# EAGLE design Controller (EAGLE 6.5.0)
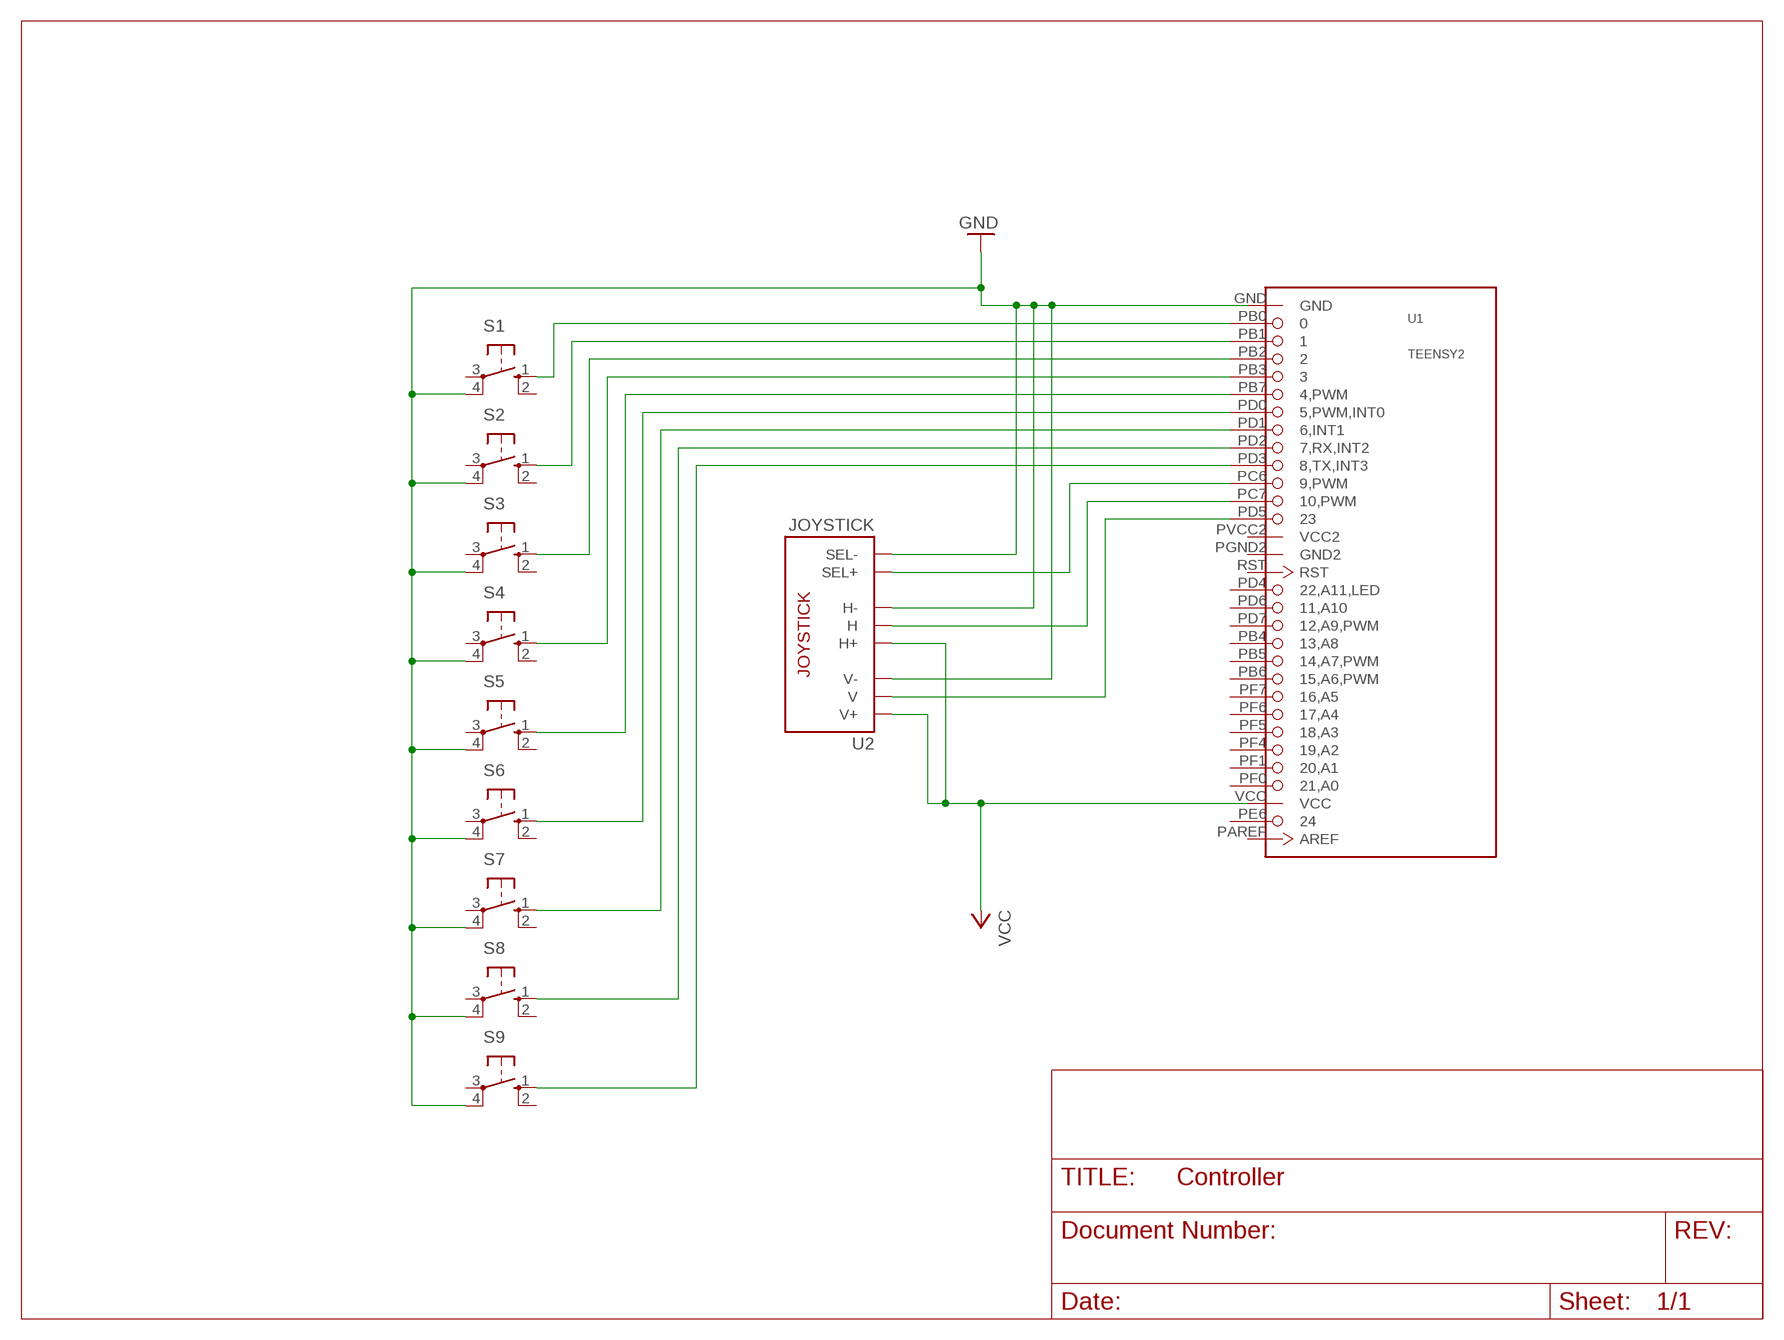
[diagram p0: schematic, sheet 1]

## Parts
S1  10-XX  [B3F-10XX]
S2  10-XX  [B3F-10XX]
S3  10-XX  [B3F-10XX]
S4  10-XX  [B3F-10XX]
S5  10-XX  [B3F-10XX]
S6  10-XX  [B3F-10XX]
S7  10-XX  [B3F-10XX]
S8  10-XX  [B3F-10XX]
S9  10-XX  [B3F-10XX]
U1  TEENSY2  TEENSY2-ARDUINO  [TEENSY2]
U2  JOYSTICK  JOYSTICKPTH  [JOYSTICK]

## Nets
GND: S1.4(P1) S2.4(P1) S3.4(P1) S4.4(P1) S5.4(P1) S6.4(P1) S7.4(P1) S8.4(P1) S9.4(P1) U1.GND U2.B2A(SEL-) U2.H3(H-) U2.V3(V-)
N$1: S1.1(S) U1.PB0
N$2: S2.1(S) U1.PB1
N$3: S3.1(S) U1.PB2
N$4: S4.1(S) U1.PB3
N$5: S5.1(S) U1.PB7(4,PWM)
N$6: S6.1(S) U1.PD0(5,PWM,INT0)
N$7: S7.1(S) U1.PD1(6,INT1)
N$8: S8.1(S) U1.PD2(7,RX,INT2)
N$9: U1.PD5 U2.V2(V)
N$10: U1.PC7(10,PWM) U2.H2(H)
N$11: U1.PC6(9,PWM) U2.B1A(SEL+)
N$12: S9.1(S) U1.PD3(8,TX,INT3)
VCC: U1.VCC U2.H1(H+) U2.V1(V+)
Unconnected: S1.2(S1) S1.3(P) S2.2(S1) S2.3(P) S3.2(S1) S3.3(P) S4.2(S1) S4.3(P) S5.2(S1) S5.3(P) S6.2(S1) S6.3(P) S7.2(S1) S7.3(P) S8.2(S1) S8.3(P) S9.2(S1) S9.3(P) U1.PAREF(AREF) U1.PB4(13,A8) U1.PB5(14,A7,PWM) U1.PB6(15,A6,PWM) U1.PD4(22,A11,LED) U1.PD6(11,A10) U1.PD7(12,A9,PWM) U1.PE6 U1.PF0(21,A0) U1.PF1(20,A1) U1.PF4(19,A2) U1.PF5(18,A3) U1.PF6(17,A4) U1.PF7(16,A5) U1.RST

## Power pins joined to a net without a drawn wire
GND2: U1.PGND2(GND2)
VCC2: U1.PVCC2(VCC2)

## Library data of the parts
S1-S9 = switch-omron:10-XX: OMRON SWITCH; MPN: B3F-1000; OC_FARNELL: 176432; OC_NEWARK: 36M3542
U1 = teensy2:TEENSY2-ARDUINO
U2 = SparkFun-Electromechanical:JOYSTICK: Thumb Joystick Joystick commonly found in PS2 controllers. Two pots and a select switch. Footprint proven. Spark Fun Electronics SKU : COM-09032

## Board
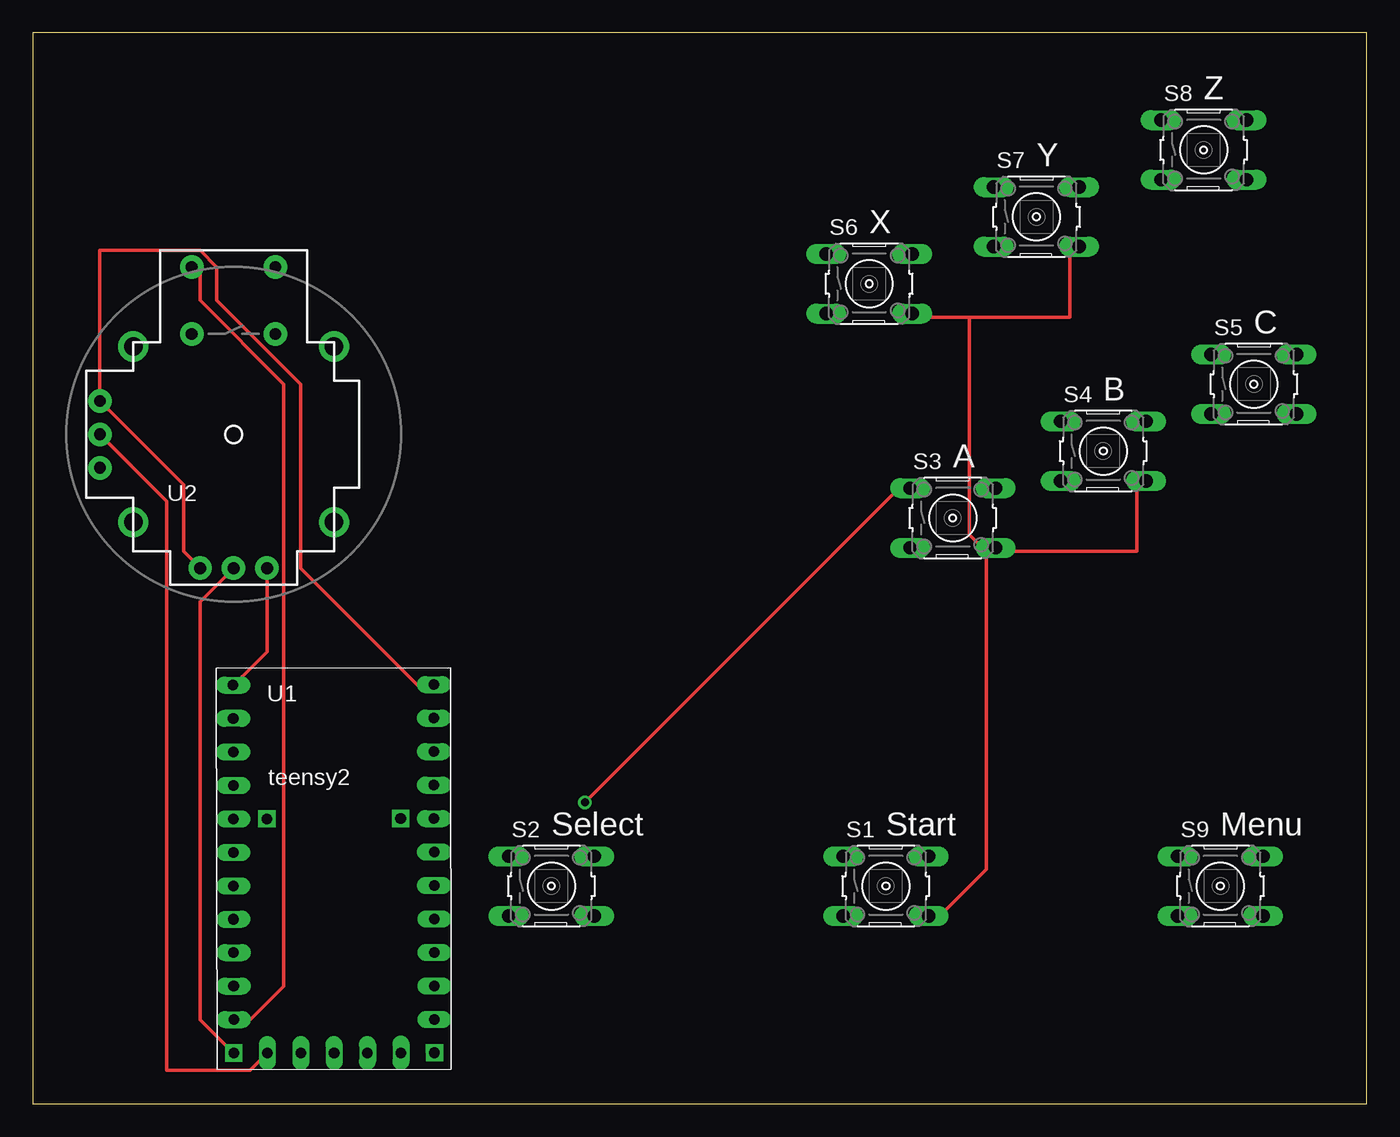
[diagram p1: board, top side]
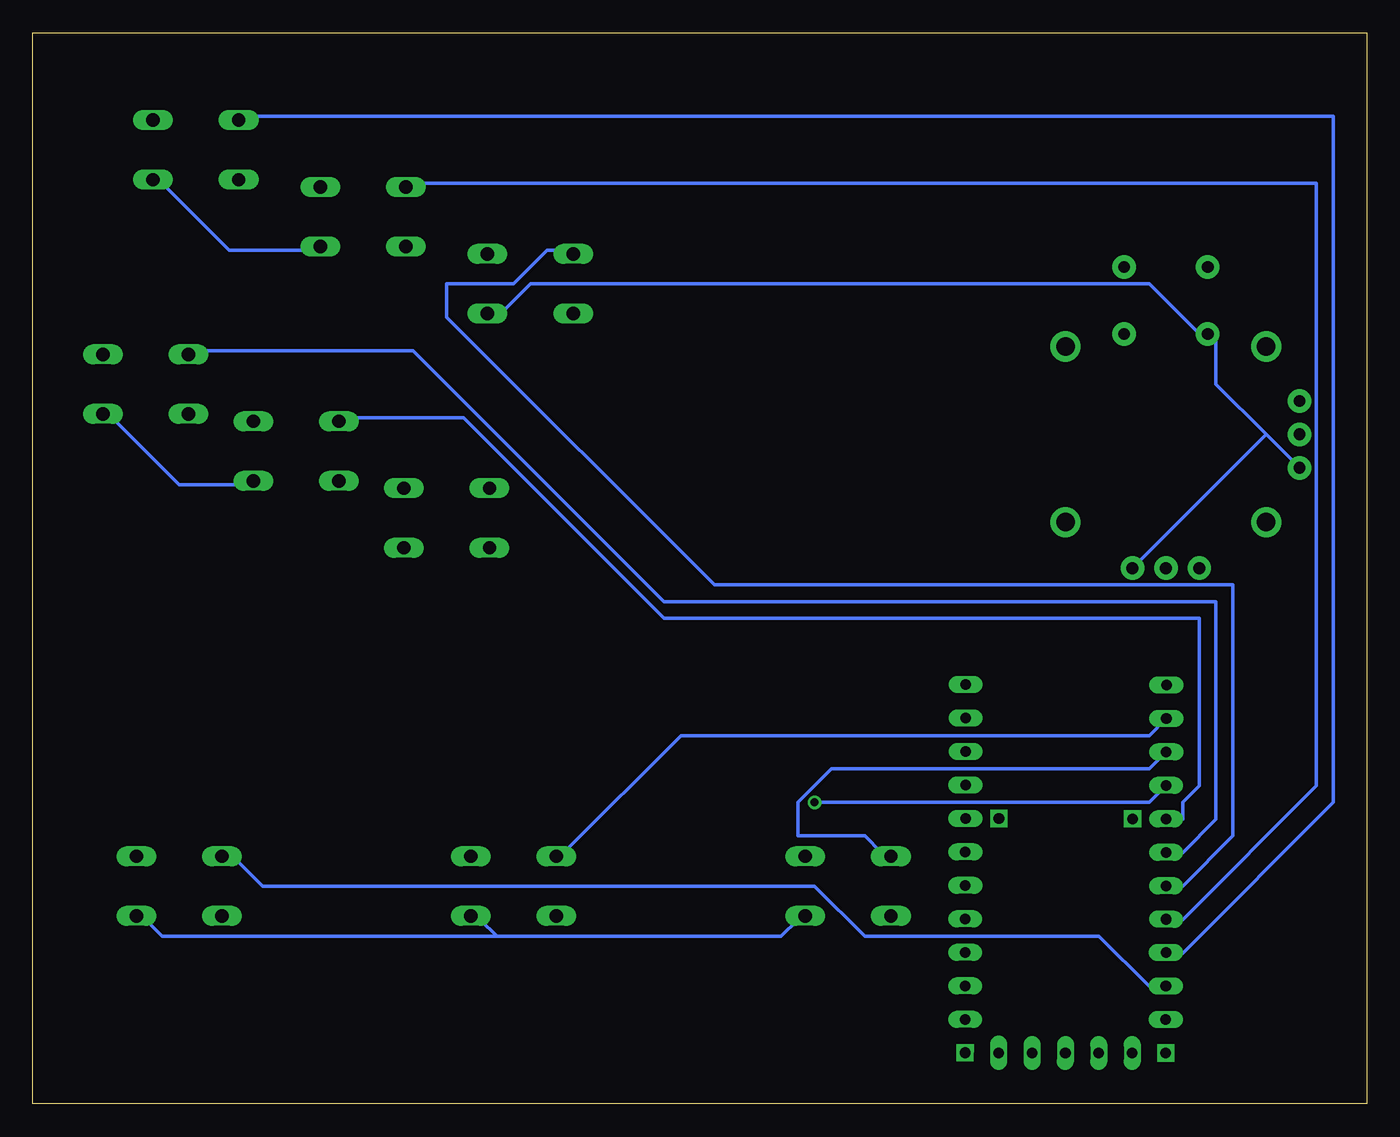
[diagram p2: board, bottom side, seen from below]

Size 101.27 x 81.27 mm. Coordinates in mm from the lower left corner, seen from the top.
Outline: 0,0 101.27,0 101.27,81.27 0,81.27 0,0
Copper layers (1*16): Top 0.035mm / dielectric 1.5mm / Bottom 0.035mm
Design rules "default": minimum track width 10mil, minimum drill 24mil, track to track 8mil, track to pad 8mil, pad to pad 8mil, via to via 8mil, smd to smd 8mil, copper to edge 40mil, drill to drill 8mil, minimum pad ring 10mil, minimum via ring 8mil, stop-mask expansion 4mil, vias tented up to drill 0mil, thermal gap 10mil

### Footprints (pad centres in the part's own frame; a part is rotated, then mirrored left to right if it is on the bottom)
B3F-10XX = drill 1.016 long: 1 -3.251,2.261; 2 3.251,2.261; 3 -3.251,-2.261; 4 3.251,-2.261
TEENSY2 = drill 0.8 long: GND 12.7,21.59; PB0 12.7,19.05; PB1 12.7,16.51; PB2 12.7,13.97; PB3 12.7,11.43; PB4 27.94,-1.27; PB5 27.94,1.27; PB6 27.94,3.81; PB7 12.7,8.89; PC6 12.7,-3.81; PD0 12.7,6.35; PD1 12.7,3.81; PD2 12.7,1.27; PD3 12.7,-1.27; PD4 25.4,-6.35; PD5 15.24,-6.35; PD7 27.94,-3.81; PF0 27.94,19.05; PF1 27.94,16.51; PF4 27.94,13.97; PF5 27.94,11.43; PF6 27.94,8.89; PF7 27.94,6.35; PGND2 20.32,-6.35; PVCC2 17.78,-6.35; RST 22.86,-6.35; VCC 27.94,21.59 | drill 0.8 square: PAREF 25.4,11.43; PC7 12.7,-6.35; PD6 27.94,-6.35; PE6 15.24,11.43
JOYSTICK = drill 0.9 pad 1.778: B1A -3.175,12.7; B1B 3.175,12.7; B2A -3.175,7.62; B2B 3.175,7.62 | drill 0.889 pad 1.778: H1 -2.54,-10.16; H2 0,-10.16; H3 2.54,-10.16; V1 -10.16,2.54; V2 -10.16,0; V3 -10.16,-2.54 | drill 1.397 pad 2.286: MOUNT1 -7.62,6.668; MOUNT2 -7.62,-6.668; MOUNT3 7.62,-6.668; MOUNT4 7.62,6.668

### Placement (x,y rotation side)
S1  64.77,16.51 0 top
S2  39.37,16.51 0 top
S3  69.85,44.45 0 top
S4  81.28,49.53 0 top
S5  92.71,54.61 0 top
S6  63.5,62.23 0 top
S7  76.2,67.31 0 top
S8  88.9,72.39 0 top
S9  90.17,16.51 0 top
U1  2.54,10.16 0.1 top
U2  15.24,50.8 0 top

### Tracks (layer width: path | path; a pad name or v marks a point on that pad's centre or on a via)
GND
  Top 0.254: U2.H3 17.78,34.29 15.24,31.75 U1.GND | S4.4 83.82,46.99 83.82,41.91 73.66,41.91 S3.4 72.39,41.91 | 71.12,59.69 78.74,59.69 78.74,64.77 S7.4 | 71.12,59.69 67.31,59.69 S6.4 | 72.39,41.91 71.12,43.18 71.12,59.69 | 72.39,41.91 72.39,17.78 68.58,13.97 S1.4
  Bottom 0.254: 66.04,12.7 44.45,12.7 43.18,13.97 S2.4 | 66.04,12.7 67.31,13.97 S1.4 | 66.04,12.7 91.44,12.7 92.71,13.97 S9.4 | 7.62,50.8 11.43,54.61 11.43,58.42 U2.B2A 12.7,58.42 16.51,62.23 63.5,62.23 66.04,59.69 S6.4 | 7.62,50.8 U2.V3 | 7.62,50.8 U2.H3 | S5.4 95.25,52.07 90.17,46.99 85.09,46.99 S4.4 | S8.4 91.44,69.85 86.36,64.77 80.01,64.77 S7.4
N$1
  Bottom 0.254: U1.PB0 15.24,29.21 16.51,27.94 52.07,27.94 60.96,19.05 S1.1
N$2
  Bottom 0.254: U1.PB1 15.24,26.67 16.51,25.4 40.64,25.4 43.18,22.86 43.18,20.32 38.1,20.32 36.83,19.05 S2.1
N$3  (via drill 0.61)
  Top 0.254: v41.91,22.86 66.04,46.99 S3.1
  Bottom 0.254: v41.91,22.86 16.51,22.86 15.24,24.13 U1.PB2
N$4
  Bottom 0.254: U1.PB3 13.97,21.59 13.97,22.86 12.7,24.13 12.7,36.83 53.34,36.83 68.58,52.07 77.47,52.07 S4.1
N$5
  Bottom 0.254: U1.PB7 13.97,19.05 11.43,21.59 11.43,38.1 53.34,38.1 72.39,57.15 88.9,57.15 S5.1
N$6
  Bottom 0.254: U1.PD0 13.97,16.51 10.16,20.32 10.16,39.37 49.53,39.37 69.85,59.69 69.85,62.23 64.77,62.23 62.23,64.77 60.96,64.77 S6.1
N$7
  Bottom 0.254: U1.PD1 13.97,13.97 3.81,24.13 3.81,69.85 72.39,69.85 S7.1
N$8
  Bottom 0.254: U1.PD2 13.97,11.43 2.54,22.86 2.54,74.93 85.09,74.93 S8.1
N$9
  Top 0.254: U2.V2 10.16,45.72 10.16,2.54 16.51,2.54 17.78,3.81 U1.PD5
N$10
  Top 0.254: U2.H2 12.7,38.1 12.7,6.35 15.24,3.81 U1.PC7
N$11
  Top 0.254: U1.PC6 16.51,6.35 19.05,8.89 19.05,54.61 12.7,60.96 12.7,63.5 U2.B1A
N$12
  Bottom 0.254: U1.PD3 16.51,8.89 20.32,12.7 38.1,12.7 41.91,16.51 83.82,16.51 86.36,19.05 S9.1
VCC
  Top 0.254: U1.VCC 29.21,31.75 20.32,40.64 20.32,54.61 13.97,60.96 13.97,63.5 12.7,64.77 5.08,64.77 U2.V1 11.43,46.99 11.43,41.91 U2.H1

### Text on the board
tNames: Z | Y | X | C | B | A | Select | Start | Menu